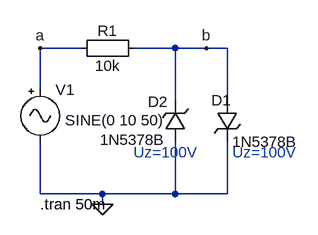
[diagram p0: schematic question_a.asc]
question_a.asc, the LTspice schematic file:
Version 4
SHEET 1 880 680
WIRE 16 112 -48 112
WIRE 160 112 96 112
WIRE 208 112 160 112
WIRE 240 112 208 112
WIRE -48 176 -48 112
WIRE 160 192 160 112
WIRE 240 192 240 112
WIRE -48 336 -48 256
WIRE 48 336 -48 336
WIRE 160 336 160 256
WIRE 160 336 48 336
WIRE 240 336 240 256
WIRE 240 336 160 336
WIRE 48 352 48 336
FLAG -48 112 a
FLAG 48 352 0
FLAG 208 112 b
SYMBOL zener 224 192 R0
WINDOW 0 -8 0 Left 2
SYMATTR InstName D1
SYMATTR Value 1N5378B
SYMATTR Description Diode
SYMATTR Type diode
SYMBOL Misc\\signal -48 160 R0
WINDOW 123 0 0 Left 2
WINDOW 39 0 0 Left 2
WINDOW 3 38 63 Left 2
SYMATTR Value SINE(0 10 50)
SYMATTR InstName V1
SYMBOL Misc\\EuropeanResistor 112 96 R90
WINDOW 0 5 56 VBottom 2
WINDOW 3 27 56 VTop 2
SYMATTR InstName R1
SYMATTR Value 10k
SYMBOL zener 176 256 R180
WINDOW 0 27 62 Left 2
WINDOW 3 31 3 Left 2
SYMATTR InstName D2
SYMATTR Value 1N5378B
SYMATTR Description Diode
SYMATTR Type diode
TEXT -48 352 Left 2 !.tran 50m
TEXT 248 272 Left 2 ;Uz=100V
TEXT 96 272 Left 2 ;Uz=100V

The netlist it stands for:
* question_a.asc
D1 b 0 1N5378B
V1 a 0 SINE(0 10 50)
R1 b a 10k
D2 0 b 1N5378B
.model D D
.lib standard.dio
.tran 50m
* Uz=100V
* Uz=100V
.backanno
.end